# Altium schematic sheet FPGA IO.SchDoc
size A1; SheetNumber: 4; SheetTotal: 16
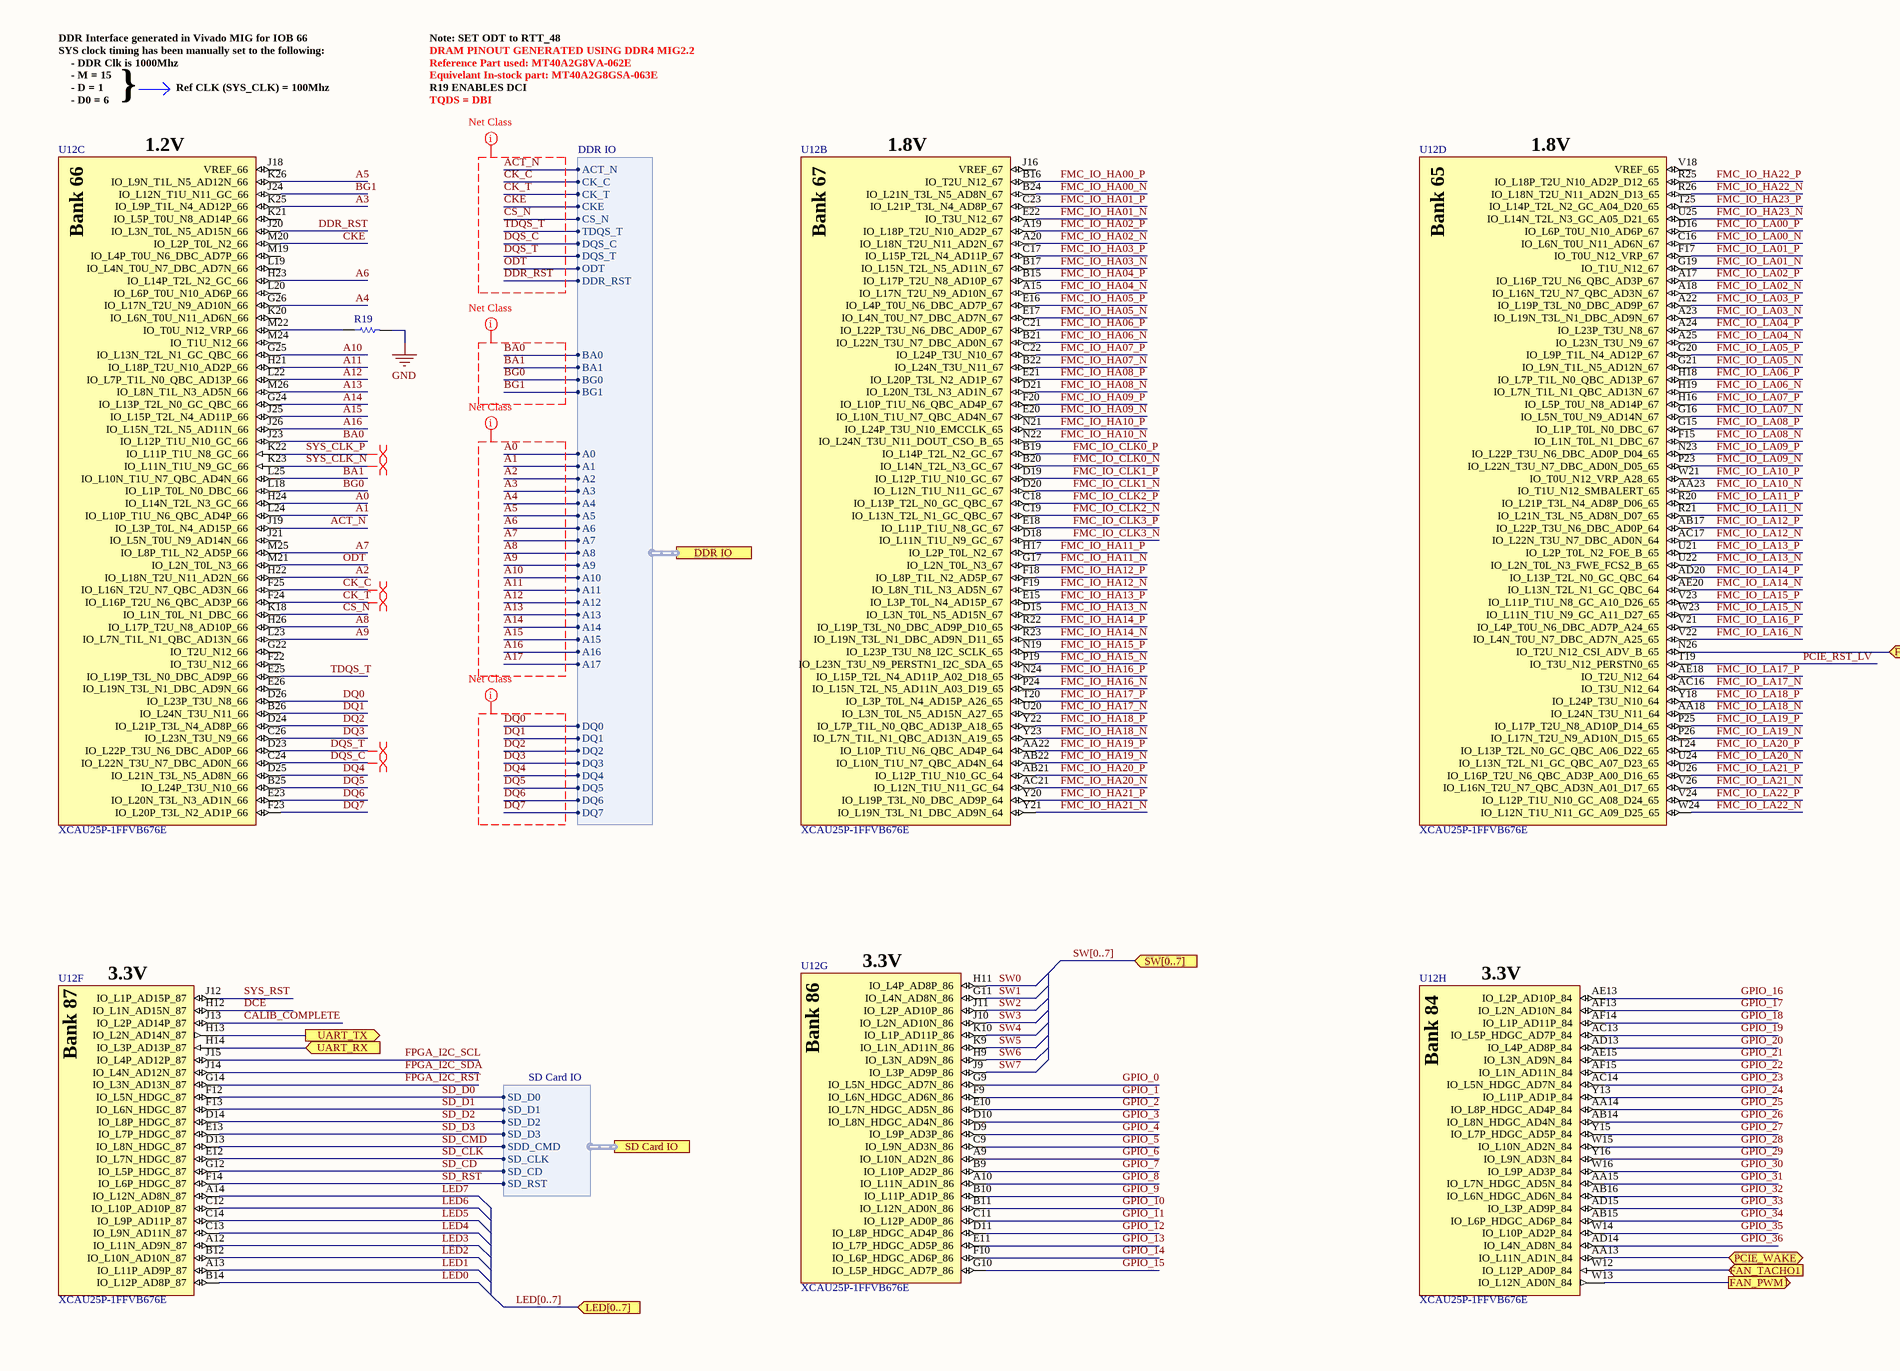
[diagram p0: FPGA IO.SchDoc, top left]
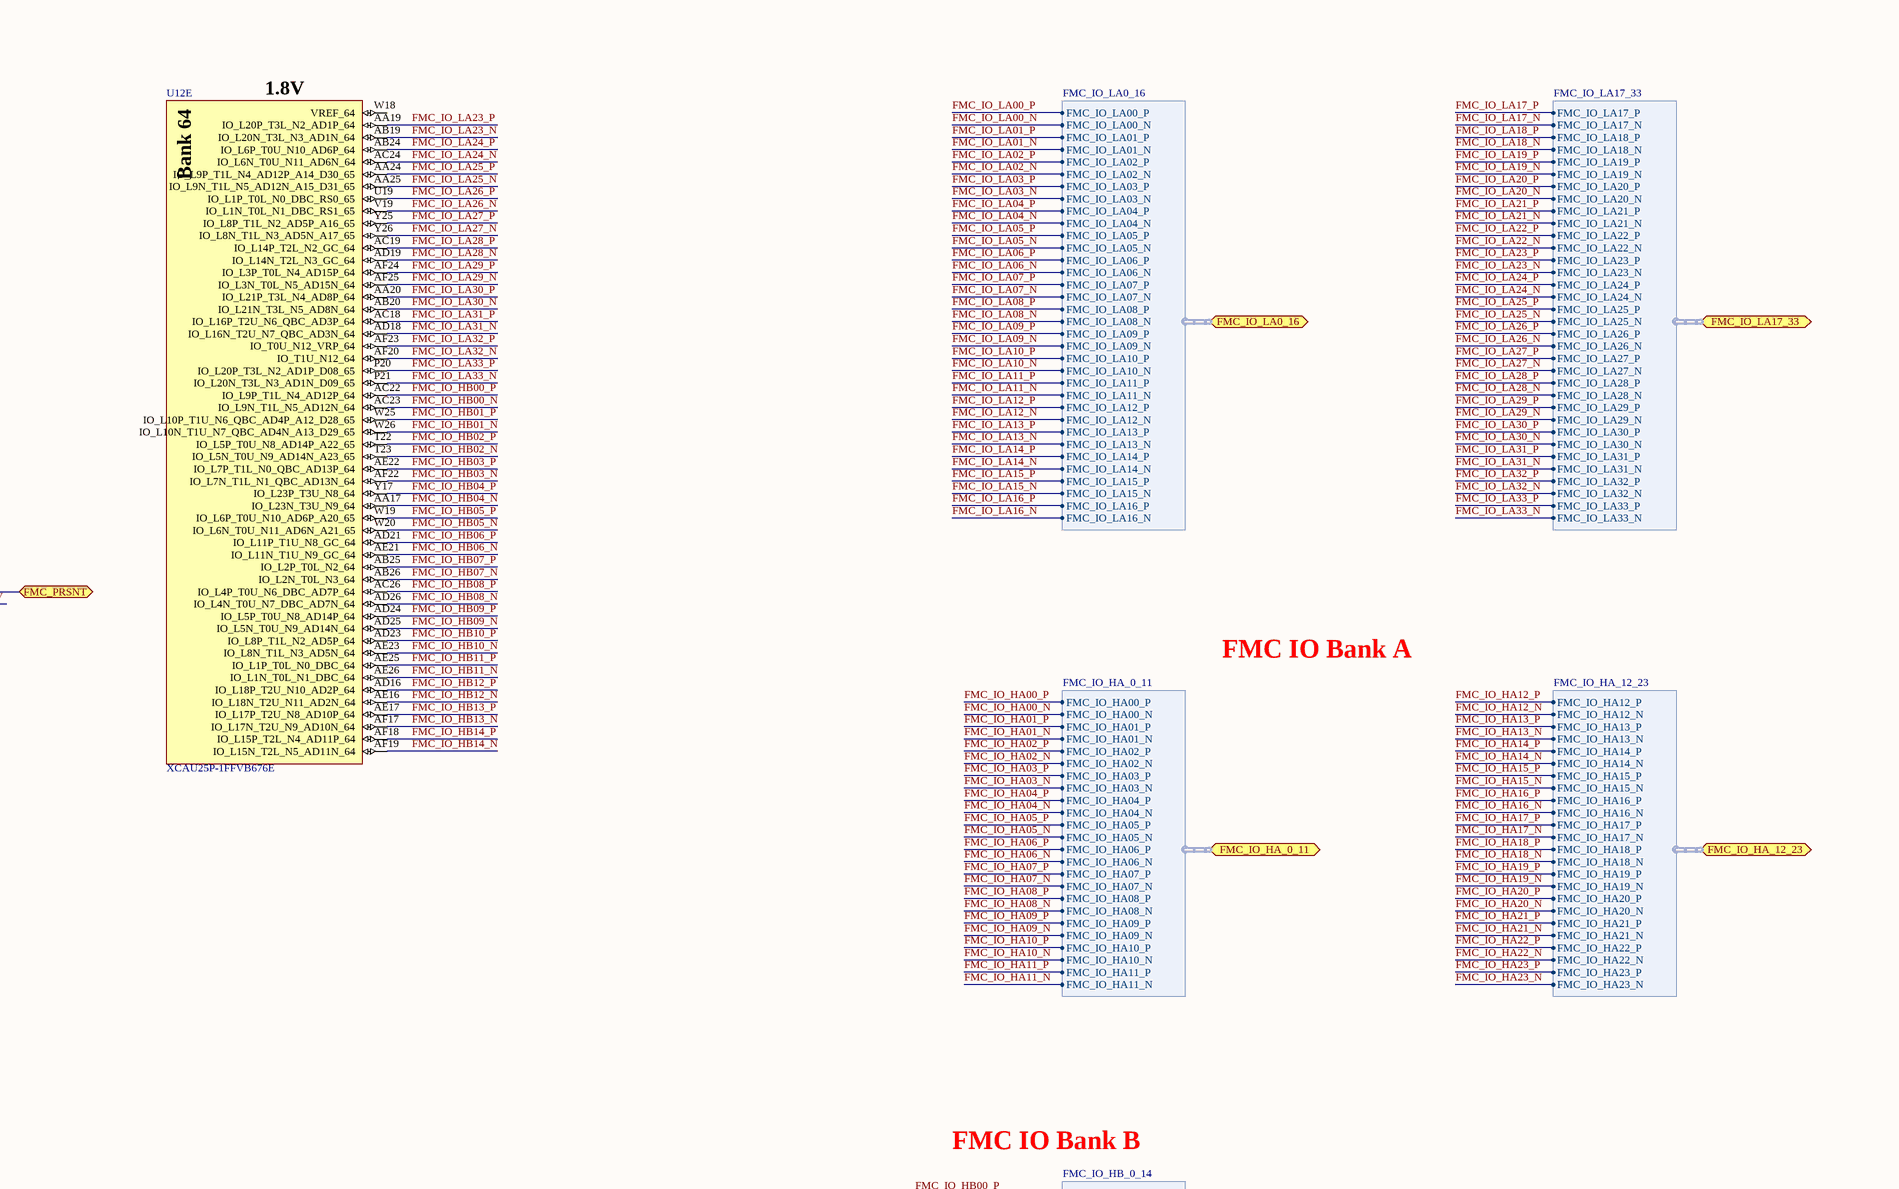
[diagram p1: FPGA IO.SchDoc, top right]
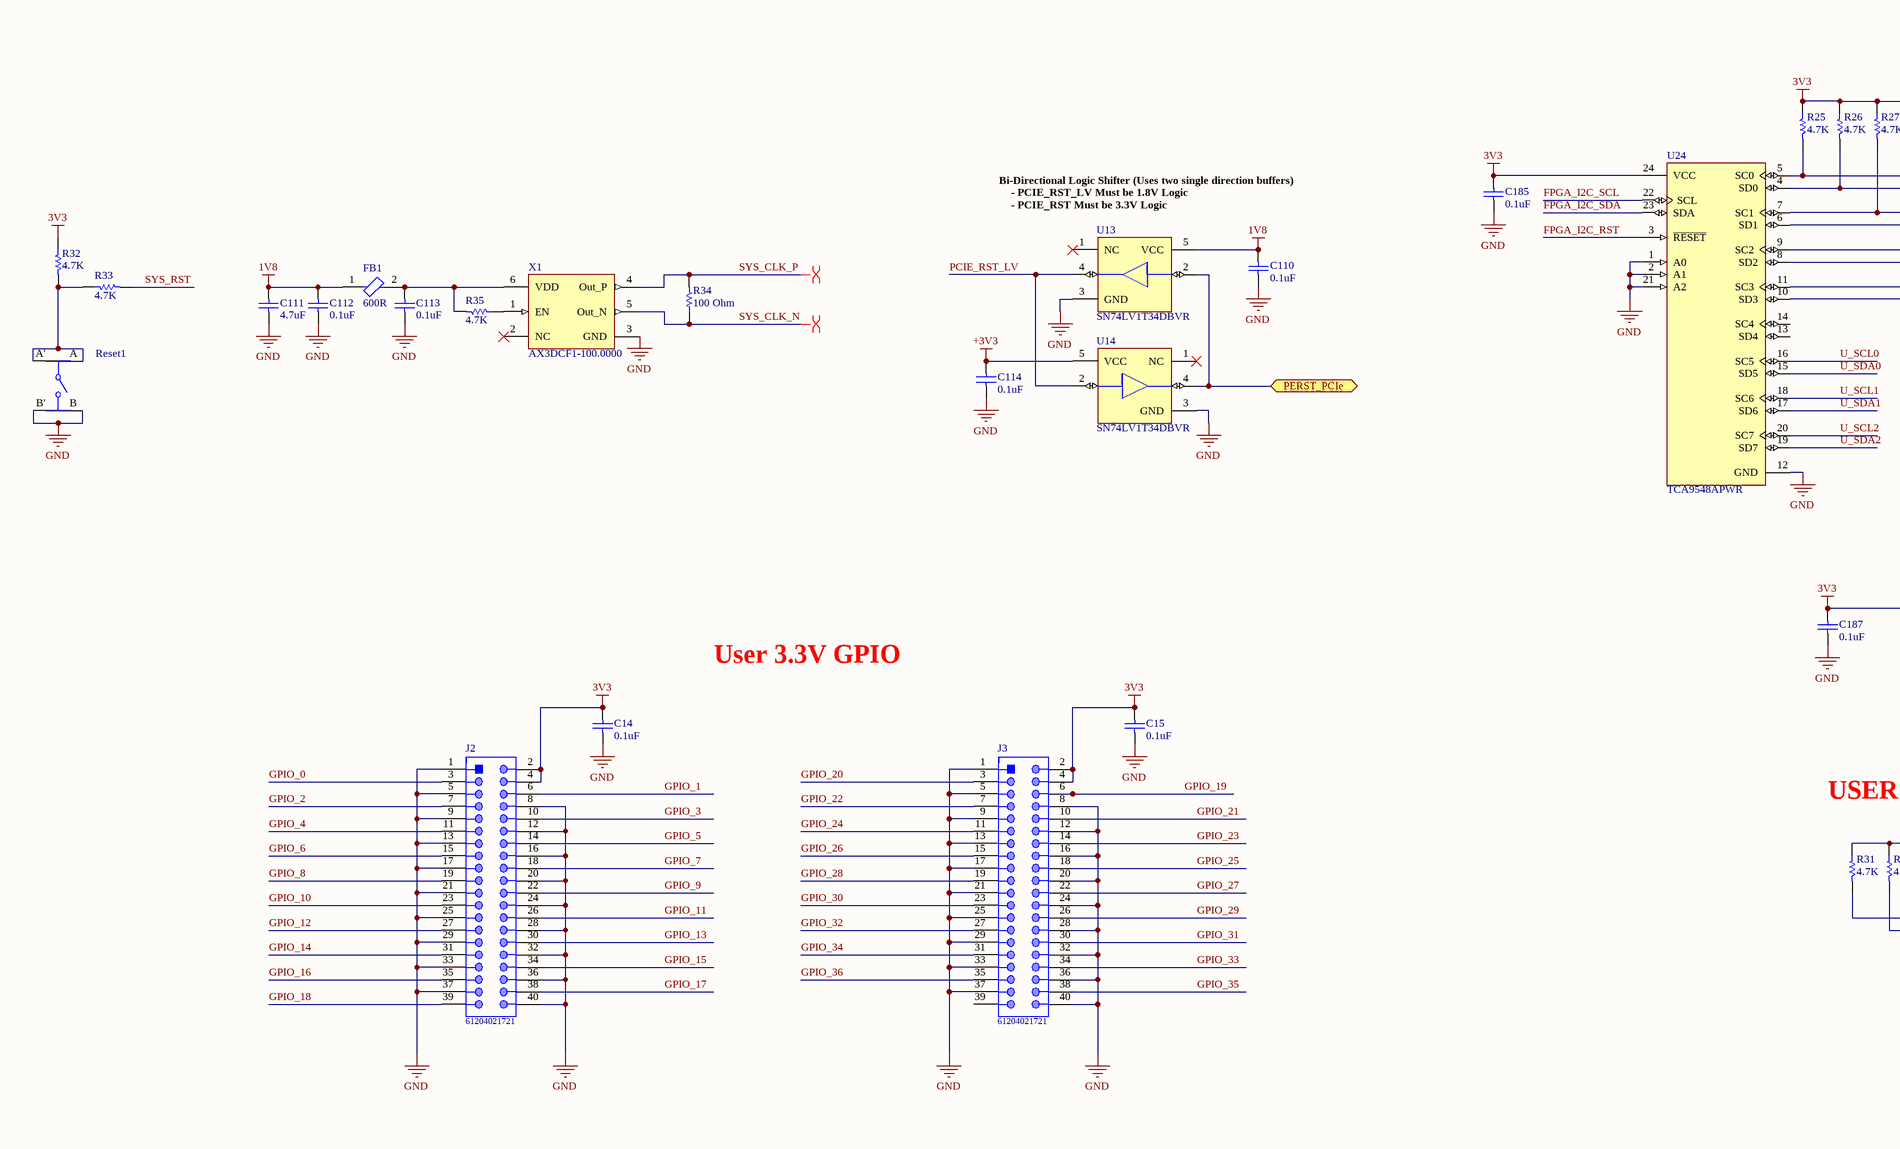
[diagram p2: FPGA IO.SchDoc, bottom left]
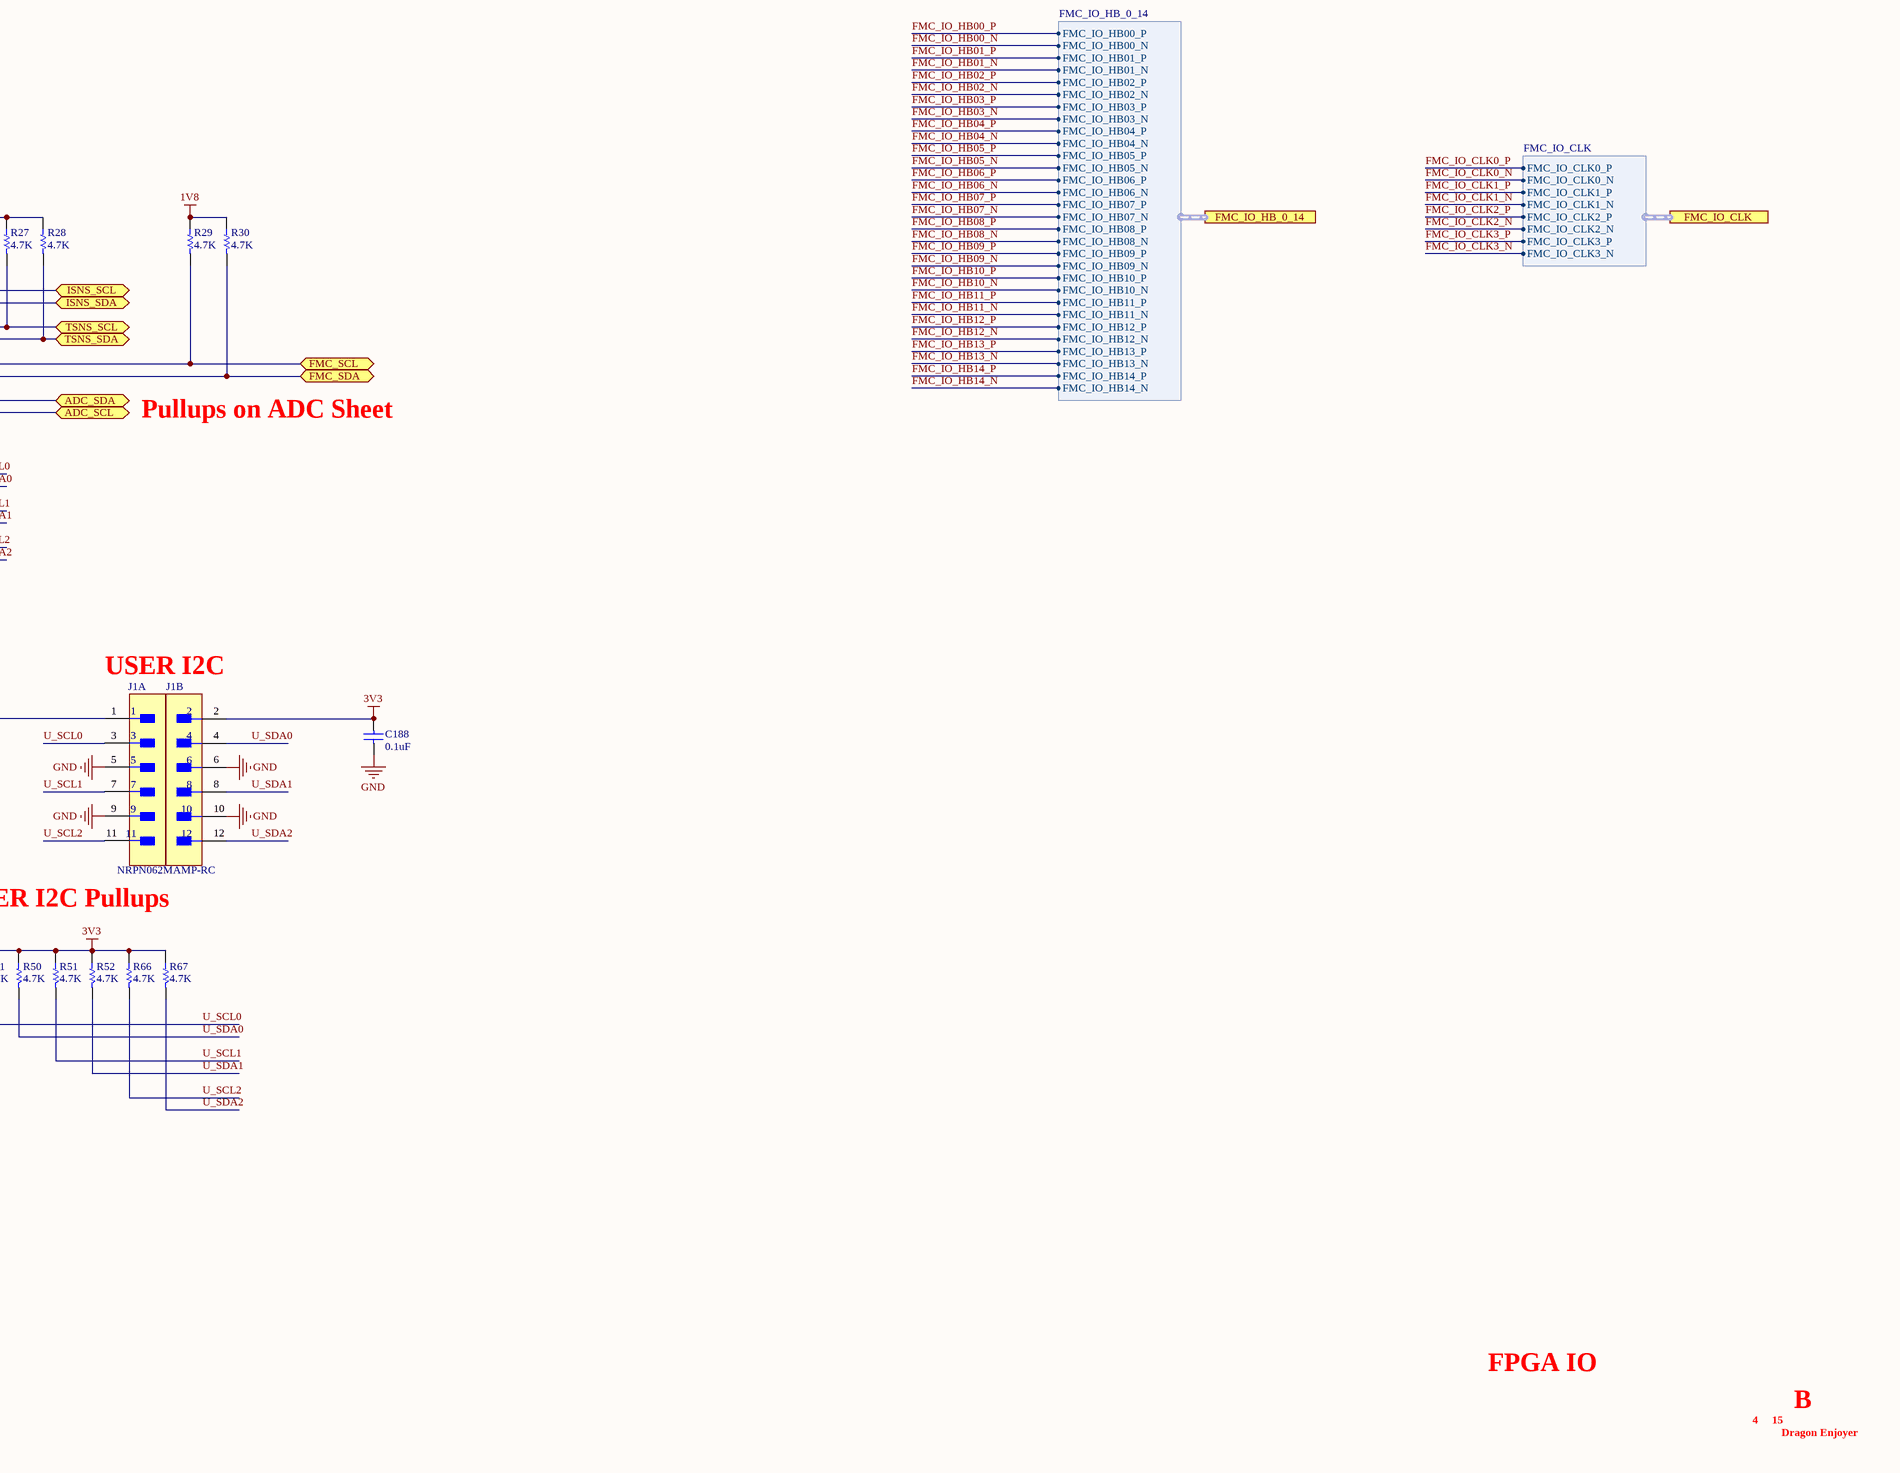
[diagram p3: FPGA IO.SchDoc, bottom right]

## Parts
C14  value 0.1uF  [CAPC1005X56X25LL10T15]  (hidden comment: 04026D104KAT2A)
C15  value 0.1uF  [CAPC1005X56X25LL10T15]  (hidden comment: 04026D104KAT2A)
C110  value 0.1uF  [CAPC1005X56X25LL10T15]  (hidden comment: 04026D104KAT2A)
C111  value 4.7uF  [CAPC2013X135X45LL10T25]  (hidden comment: GRM21BR71A475KA73L)
C112  value 0.1uF  [CAPC1005X56X25LL10T15]  (hidden comment: 04026D104KAT2A)
C113  value 0.1uF  [CAPC1005X56X25LL10T15]  (hidden comment: 04026D104KAT2A)
C114  value 0.1uF  [CAPC1005X56X25LL10T15]  (hidden comment: 04026D104KAT2A)
C185  value 0.1uF  [CAPC1005X56X25LL10T15]  (hidden comment: 04026D104KAT2A)
C187  value 0.1uF  [CAPC1005X56X25LL10T15]  (hidden comment: 04026D104KAT2A)
C188  value 0.1uF  [CAPC1005X56X25LL10T15]  (hidden comment: 04026D104KAT2A)
FB1  Impedance: 600R  [FP-BLM18-0_15-t0_8-IPC_A]  (hidden comment: BLM18KG601SN1D)
J1  NRPN062MAMP-RC  [FP-NRPN062MAMP-RC-MFG]  (value not drawn)  (parts A,B of 2)
J2  61204021721  [61204021721]
J3  61204021721  [61204021721]
R19  CRCW0402240RFKED  [RESC1005X40X25ML05T05]  (value not drawn)
R25  value 4.7K  [RESC1005X40X25LL05T10]  (hidden comment: RC0402JR-074K7L)
R26  value 4.7K  [RESC1005X40X25LL05T10]  (hidden comment: RC0402JR-074K7L)
R27  value 4.7K  [RESC1005X40X25LL05T10]  (hidden comment: RC0402JR-074K7L)
R28  value 4.7K  [RESC1005X40X25LL05T10]  (hidden comment: RC0402JR-074K7L)
R29  value 4.7K  [RESC1005X40X25LL05T10]  (hidden comment: RC0402JR-074K7L)
R30  value 4.7K  [RESC1005X40X25LL05T10]  (hidden comment: RC0402JR-074K7L)
R31  value 4.7K  [RESC1005X40X25LL05T10]  (hidden comment: RC0402JR-074K7L)
R32  value 4.7K  [RESC1005X40X25LL05T10]  (hidden comment: RC0402JR-074K7L)
R33  value 4.7K  [RESC1005X40X25LL05T10]  (hidden comment: RC0402JR-074K7L)
R34  Resistance: 100 Ohm  [RESC1005X40X25LL05T05]  (hidden comment: ERJ-2RKF1000X)
R35  value 4.7K  [RESC1005X40X25LL05T10]  (hidden comment: RC0402JR-074K7L)
R50  value 4.7K  [RESC1005X40X25LL05T10]  (hidden comment: RC0402JR-074K7L)
R51  value 4.7K  [RESC1005X40X25LL05T10]  (hidden comment: RC0402JR-074K7L)
R52  value 4.7K  [RESC1005X40X25LL05T10]  (hidden comment: RC0402JR-074K7L)
R66  value 4.7K  [RESC1005X40X25LL05T10]  (hidden comment: RC0402JR-074K7L)
R67  value 4.7K  [RESC1005X40X25LL05T10]  (hidden comment: RC0402JR-074K7L)
Reset1  EVQ-Q2U03W  [FP-EVQQ2-MFG]  (value not drawn)
U12  XCAU25P-1FFVB676E  [BGA676C100P26X26_2600X2600X352]  (parts B,C,D,E,F,G,H of 14)
U13  SN74LV1T34DBVR  [FP-DBV0005A-MFG]
U14  SN74LV1T34DBVR  [FP-DBV0005A-MFG]
U24  TCA9548APWR  [FP-PW0024A-MFG]
X1  AX3DCF1-100.0000  [CAF-120P320X250-6N]

## Ports
ADC_SCL (bidir), ADC_SDA (bidir), DDR IO (harness DDR IO), FAN_PWM1 (out), FAN_TACHO1 (in), FMC_IO_CLK (harness FMC_IO_CLK), FMC_IO_HA_0_11 (bidir, harness FMC_IO_HA_0_11), FMC_IO_HA_12_23 (bidir, harness FMC_IO_HA_12_23), FMC_IO_HB_0_14 (harness FMC_IO_HB_0_14), FMC_IO_LA0_16 (bidir, harness FMC_IO_LA0_16), FMC_IO_LA17_33 (bidir, harness FMC_IO_LA17_33), FMC_PRSNT (bidir), FMC_SCL (bidir), FMC_SDA (bidir), ISNS_SCL (bidir), ISNS_SDA (bidir), LED[0..7] (in), PCIE_WAKE (bidir), PERST_PCIe (bidir), SD Card IO (harness SD Card IO), SW[0..7] (in), TSNS_SCL (bidir), TSNS_SDA (bidir), UART_RX (in), UART_TX (out)

## Harnesses
DDR IO: ACT_N, CK_C, CK_T, CKE, TDQS_T, DQS_C, DQS_T, ODT, BA0, BA1, BG0, BG1, A0, A1, A2, A3, A4, A5, A6, A7, A8, A9, A10, A11, A12, A13, A14, A15, A16, A17, DQ0, DQ1, DQ2, DQ3, DQ4, DQ5, DQ6, DQ7, DDR_RST, CS_N
FMC_IO_LA0_16: FMC_IO_LA00_P, FMC_IO_LA00_N, FMC_IO_LA01_P, FMC_IO_LA01_N, FMC_IO_LA02_P, FMC_IO_LA02_N, FMC_IO_LA03_P, FMC_IO_LA03_N, FMC_IO_LA04_P, FMC_IO_LA04_N, FMC_IO_LA05_P, FMC_IO_LA05_N, FMC_IO_LA06_P, FMC_IO_LA06_N, FMC_IO_LA07_P, FMC_IO_LA07_N, FMC_IO_LA08_P, FMC_IO_LA08_N, FMC_IO_LA09_P, FMC_IO_LA09_N, FMC_IO_LA10_P, FMC_IO_LA10_N, FMC_IO_LA11_P, FMC_IO_LA11_N, FMC_IO_LA12_P, FMC_IO_LA12_N, FMC_IO_LA13_P, FMC_IO_LA13_N, FMC_IO_LA14_P, FMC_IO_LA14_N, FMC_IO_LA15_P, FMC_IO_LA15_N, FMC_IO_LA16_P, FMC_IO_LA16_N
FMC_IO_LA17_33: FMC_IO_LA17_P, FMC_IO_LA17_N, FMC_IO_LA18_P, FMC_IO_LA18_N, FMC_IO_LA19_P, FMC_IO_LA19_N, FMC_IO_LA20_P, FMC_IO_LA20_N, FMC_IO_LA21_P, FMC_IO_LA21_N, FMC_IO_LA22_P, FMC_IO_LA22_N, FMC_IO_LA23_P, FMC_IO_LA23_N, FMC_IO_LA24_P, FMC_IO_LA24_N, FMC_IO_LA25_P, FMC_IO_LA25_N, FMC_IO_LA26_P, FMC_IO_LA26_N, FMC_IO_LA27_P, FMC_IO_LA27_N, FMC_IO_LA28_P, FMC_IO_LA28_N, FMC_IO_LA29_P, FMC_IO_LA29_N, FMC_IO_LA30_P, FMC_IO_LA30_N, FMC_IO_LA31_P, FMC_IO_LA31_N, FMC_IO_LA32_P, FMC_IO_LA32_N, FMC_IO_LA33_P, FMC_IO_LA33_N
FMC_IO_HA_0_11: FMC_IO_HA00_P, FMC_IO_HA00_N, FMC_IO_HA01_P, FMC_IO_HA01_N, FMC_IO_HA02_P, FMC_IO_HA02_N, FMC_IO_HA03_P, FMC_IO_HA03_N, FMC_IO_HA04_P, FMC_IO_HA04_N, FMC_IO_HA05_P, FMC_IO_HA05_N, FMC_IO_HA06_P, FMC_IO_HA06_N, FMC_IO_HA07_P, FMC_IO_HA07_N, FMC_IO_HA08_P, FMC_IO_HA08_N, FMC_IO_HA09_P, FMC_IO_HA09_N, FMC_IO_HA10_P, FMC_IO_HA10_N, FMC_IO_HA11_P, FMC_IO_HA11_N
FMC_IO_HA_12_23: FMC_IO_HA12_P, FMC_IO_HA12_N, FMC_IO_HA13_P, FMC_IO_HA13_N, FMC_IO_HA14_P, FMC_IO_HA14_N, FMC_IO_HA15_P, FMC_IO_HA15_N, FMC_IO_HA16_P, FMC_IO_HA16_N, FMC_IO_HA17_P, FMC_IO_HA17_N, FMC_IO_HA18_P, FMC_IO_HA18_N, FMC_IO_HA19_P, FMC_IO_HA19_N, FMC_IO_HA20_P, FMC_IO_HA20_N, FMC_IO_HA21_P, FMC_IO_HA21_N, FMC_IO_HA22_P, FMC_IO_HA22_N, FMC_IO_HA23_P, FMC_IO_HA23_N
FMC_IO_CLK: FMC_IO_CLK0_P, FMC_IO_CLK0_N, FMC_IO_CLK1_P, FMC_IO_CLK1_N, FMC_IO_CLK2_P, FMC_IO_CLK2_N, FMC_IO_CLK3_P, FMC_IO_CLK3_N
FMC_IO_HB_0_14: FMC_IO_HB00_P, FMC_IO_HB00_N, FMC_IO_HB01_P, FMC_IO_HB01_N, FMC_IO_HB02_P, FMC_IO_HB02_N, FMC_IO_HB03_P, FMC_IO_HB03_N, FMC_IO_HB04_P, FMC_IO_HB04_N, FMC_IO_HB05_P, FMC_IO_HB05_N, FMC_IO_HB06_P, FMC_IO_HB06_N, FMC_IO_HB07_P, FMC_IO_HB07_N, FMC_IO_HB08_P, FMC_IO_HB08_N, FMC_IO_HB09_P, FMC_IO_HB09_N, FMC_IO_HB10_P, FMC_IO_HB10_N, FMC_IO_HB11_P, FMC_IO_HB11_N, FMC_IO_HB12_P, FMC_IO_HB12_N, FMC_IO_HB13_P, FMC_IO_HB13_N, FMC_IO_HB14_P, FMC_IO_HB14_N
SD Card IO: SD_D0, SD_D1, SD_D2, SD_D3, SDD_CMD, SD_CLK, SD_CD, SD_RST

## Nets
1V8: C110.2 C111.2 C112.2 FB1.1 R29.1 R30.1 U13.5(VCC)
3V3: C14.2 C15.2 C185.1 C187.1 C188.1 J1.1 J1.2 J2.2 J2.4 J3.2 J3.4 R25.1 R26.1 R27.1 R28.1 R31.1 R32.1 R50.1 R51.1 R52.1 R66.1 R67.1 U24.24(VCC)
+3V3: C114.2 U14.5(VCC)
GND: C14.1 C15.1 C110.1 C111.1 C112.1 C113.1 C114.1 C185.2 C187.2 C188.2 J1.5 J1.6 J1.9 J1.10 J2.1 J2.5 J2.8 J2.9 J2.12 J2.13 J2.16 J2.17 J2.20 J2.21 J2.24 J2.25 J2.28 J2.29 J2.32 J2.33 J2.36 J2.37 J2.40 J3.1 J3.5 J3.8 J3.9 J3.12 J3.13 J3.16 J3.17 J3.20 J3.21 J3.24 J3.25 J3.28 J3.29 J3.32 J3.33 J3.36 J3.37 J3.40 R19.2 Reset1.B Reset1.B' U13.3(GND) U14.3(GND) U24.1(A0) U24.2(A1) U24.12(GND) U24.21(A2) X1.3(GND)
A0: U12.H24(IO_L14N_T2L_N3_GC_66) ; port DDR IO.A0
A1: U12.L24(IO_L10P_T1U_N6_QBC_AD4P_66) ; port DDR IO.A1
A2: U12.H22(IO_L18N_T2U_N11_AD2N_66) ; port DDR IO.A2
A3: U12.K25(IO_L9P_T1L_N4_AD12P_66) ; port DDR IO.A3
A4: U12.G26(IO_L17N_T2U_N9_AD10N_66) ; port DDR IO.A4
A5: U12.K26(IO_L9N_T1L_N5_AD12N_66) ; port DDR IO.A5
A6: U12.H23(IO_L14P_T2L_N2_GC_66) ; port DDR IO.A6
A7: U12.M25(IO_L8P_T1L_N2_AD5P_66) ; port DDR IO.A7
A8: U12.H26(IO_L17P_T2U_N8_AD10P_66) ; port DDR IO.A8
A9: U12.L23(IO_L7N_T1L_N1_QBC_AD13N_66) ; port DDR IO.A9
A10: U12.G25(IO_L13N_T2L_N1_GC_QBC_66) ; port DDR IO.A10
A11: U12.H21(IO_L18P_T2U_N10_AD2P_66) ; port DDR IO.A11
A12: U12.L22(IO_L7P_T1L_N0_QBC_AD13P_66) ; port DDR IO.A12
A13: U12.M26(IO_L8N_T1L_N3_AD5N_66) ; port DDR IO.A13
A14: U12.G24(IO_L13P_T2L_N0_GC_QBC_66) ; port DDR IO.A14
A15: U12.J25(IO_L15P_T2L_N4_AD11P_66) ; port DDR IO.A15
A16: U12.J26(IO_L15N_T2L_N5_AD11N_66) ; port DDR IO.A16
A17: port DDR IO.A17
ACT_N: U12.J19(IO_L3P_T0L_N4_AD15P_66) ; port DDR IO.ACT_N
ADC_SCL: U24.10(SD3) ; port ADC_SCL
ADC_SDA: U24.11(SC3) ; port ADC_SDA
BA0: U12.J23(IO_L12P_T1U_N10_GC_66) ; port DDR IO.BA0
BA1: U12.L25(IO_L10N_T1U_N7_QBC_AD4N_66) ; port DDR IO.BA1
BG0: U12.L18(IO_L1P_T0L_N0_DBC_66) ; port DDR IO.BG0
BG1: U12.J24(IO_L12N_T1U_N11_GC_66) ; port DDR IO.BG1
CALIB_COMPLETE: U12.J13(IO_L2P_AD14P_87)
CK_C: U12.F25(IO_L16N_T2U_N7_QBC_AD3N_66) ; port DDR IO.CK_C
CK_T: U12.F24(IO_L16P_T2U_N6_QBC_AD3P_66) ; port DDR IO.CK_T
CKE: U12.M20(IO_L2P_T0L_N2_66) ; port DDR IO.CKE
CS_N: U12.K18(IO_L1N_T0L_N1_DBC_66) ; port DDR IO.CS_N
DCE: U12.H12(IO_L1N_AD15N_87)
DDR_RST: U12.J20(IO_L3N_T0L_N5_AD15N_66) ; port DDR IO.DDR_RST
DQ0: U12.D26(IO_L23P_T3U_N8_66) ; port DDR IO.DQ0
DQ1: U12.B26(IO_L24N_T3U_N11_66) ; port DDR IO.DQ1
DQ2: U12.D24(IO_L21P_T3L_N4_AD8P_66) ; port DDR IO.DQ2
DQ3: U12.C26(IO_L23N_T3U_N9_66) ; port DDR IO.DQ3
DQ4: U12.D25(IO_L21N_T3L_N5_AD8N_66) ; port DDR IO.DQ4
DQ5: U12.B25(IO_L24P_T3U_N10_66) ; port DDR IO.DQ5
DQ6: U12.E23(IO_L20N_T3L_N3_AD1N_66) ; port DDR IO.DQ6
DQ7: U12.F23(IO_L20P_T3L_N2_AD1P_66) ; port DDR IO.DQ7
DQS_C: U12.C24(IO_L22N_T3U_N7_DBC_AD0N_66) ; port DDR IO.DQS_C
DQS_T: U12.D23(IO_L22P_T3U_N6_DBC_AD0P_66) ; port DDR IO.DQS_T
FAN_PWM1: U12.W13(IO_L12N_AD0N_84) ; port FAN_PWM1
FAN_TACHO1: U12.W12(IO_L12P_AD0P_84) ; port FAN_TACHO1
FMC_IO_CLK0_N: U12.B20(IO_L14N_T2L_N3_GC_67) ; port FMC_IO_CLK.FMC_IO_CLK0_N
FMC_IO_CLK0_P: U12.B19(IO_L14P_T2L_N2_GC_67) ; port FMC_IO_CLK.FMC_IO_CLK0_P
FMC_IO_CLK1_N: U12.D20(IO_L12N_T1U_N11_GC_67) ; port FMC_IO_CLK.FMC_IO_CLK1_N
FMC_IO_CLK1_P: U12.D19(IO_L12P_T1U_N10_GC_67) ; port FMC_IO_CLK.FMC_IO_CLK1_P
FMC_IO_CLK2_N: U12.C19(IO_L13N_T2L_N1_GC_QBC_67) ; port FMC_IO_CLK.FMC_IO_CLK2_N
FMC_IO_CLK2_P: U12.C18(IO_L13P_T2L_N0_GC_QBC_67) ; port FMC_IO_CLK.FMC_IO_CLK2_P
FMC_IO_CLK3_N: U12.D18(IO_L11N_T1U_N9_GC_67) ; port FMC_IO_CLK.FMC_IO_CLK3_N
FMC_IO_CLK3_P: U12.E18(IO_L11P_T1U_N8_GC_67) ; port FMC_IO_CLK.FMC_IO_CLK3_P
FMC_IO_HA00_N: U12.B24(IO_L21N_T3L_N5_AD8N_67) ; port FMC_IO_HA_0_11.FMC_IO_HA00_N
FMC_IO_HA00_P: U12.B16(IO_T2U_N12_67) ; port FMC_IO_HA_0_11.FMC_IO_HA00_P
FMC_IO_HA01_N: U12.E22(IO_T3U_N12_67) ; port FMC_IO_HA_0_11.FMC_IO_HA01_N
FMC_IO_HA01_P: U12.C23(IO_L21P_T3L_N4_AD8P_67) ; port FMC_IO_HA_0_11.FMC_IO_HA01_P
FMC_IO_HA02_N: U12.A20(IO_L18N_T2U_N11_AD2N_67) ; port FMC_IO_HA_0_11.FMC_IO_HA02_N
FMC_IO_HA02_P: U12.A19(IO_L18P_T2U_N10_AD2P_67) ; port FMC_IO_HA_0_11.FMC_IO_HA02_P
FMC_IO_HA03_N: U12.B17(IO_L15N_T2L_N5_AD11N_67) ; port FMC_IO_HA_0_11.FMC_IO_HA03_N
FMC_IO_HA03_P: U12.C17(IO_L15P_T2L_N4_AD11P_67) ; port FMC_IO_HA_0_11.FMC_IO_HA03_P
FMC_IO_HA04_N: U12.A15(IO_L17N_T2U_N9_AD10N_67) ; port FMC_IO_HA_0_11.FMC_IO_HA04_N
FMC_IO_HA04_P: U12.B15(IO_L17P_T2U_N8_AD10P_67) ; port FMC_IO_HA_0_11.FMC_IO_HA04_P
FMC_IO_HA05_N: U12.E17(IO_L4N_T0U_N7_DBC_AD7N_67) ; port FMC_IO_HA_0_11.FMC_IO_HA05_N
FMC_IO_HA05_P: U12.E16(IO_L4P_T0U_N6_DBC_AD7P_67) ; port FMC_IO_HA_0_11.FMC_IO_HA05_P
FMC_IO_HA06_N: U12.B21(IO_L22N_T3U_N7_DBC_AD0N_67) ; port FMC_IO_HA_0_11.FMC_IO_HA06_N
FMC_IO_HA06_P: U12.C21(IO_L22P_T3U_N6_DBC_AD0P_67) ; port FMC_IO_HA_0_11.FMC_IO_HA06_P
FMC_IO_HA07_N: U12.B22(IO_L24N_T3U_N11_67) ; port FMC_IO_HA_0_11.FMC_IO_HA07_N
FMC_IO_HA07_P: U12.C22(IO_L24P_T3U_N10_67) ; port FMC_IO_HA_0_11.FMC_IO_HA07_P
FMC_IO_HA08_N: U12.D21(IO_L20N_T3L_N3_AD1N_67) ; port FMC_IO_HA_0_11.FMC_IO_HA08_N
FMC_IO_HA08_P: U12.E21(IO_L20P_T3L_N2_AD1P_67) ; port FMC_IO_HA_0_11.FMC_IO_HA08_P
FMC_IO_HA09_N: U12.E20(IO_L10N_T1U_N7_QBC_AD4N_67) ; port FMC_IO_HA_0_11.FMC_IO_HA09_N
FMC_IO_HA09_P: U12.F20(IO_L10P_T1U_N6_QBC_AD4P_67) ; port FMC_IO_HA_0_11.FMC_IO_HA09_P
FMC_IO_HA10_N: U12.N22(IO_L24N_T3U_N11_DOUT_CSO_B_65) ; port FMC_IO_HA_0_11.FMC_IO_HA10_N
FMC_IO_HA10_P: U12.N21(IO_L24P_T3U_N10_EMCCLK_65) ; port FMC_IO_HA_0_11.FMC_IO_HA10_P
FMC_IO_HA11_N: U12.G17(IO_L2N_T0L_N3_67) ; port FMC_IO_HA_0_11.FMC_IO_HA11_N
FMC_IO_HA11_P: U12.H17(IO_L2P_T0L_N2_67) ; port FMC_IO_HA_0_11.FMC_IO_HA11_P
FMC_IO_HA12_N: U12.F19(IO_L8N_T1L_N3_AD5N_67) ; port FMC_IO_HA_12_23.FMC_IO_HA12_N
FMC_IO_HA12_P: U12.F18(IO_L8P_T1L_N2_AD5P_67) ; port FMC_IO_HA_12_23.FMC_IO_HA12_P
FMC_IO_HA13_N: U12.D15(IO_L3N_T0L_N5_AD15N_67) ; port FMC_IO_HA_12_23.FMC_IO_HA13_N
FMC_IO_HA13_P: U12.E15(IO_L3P_T0L_N4_AD15P_67) ; port FMC_IO_HA_12_23.FMC_IO_HA13_P
FMC_IO_HA14_N: U12.R23(IO_L19N_T3L_N1_DBC_AD9N_D11_65) ; port FMC_IO_HA_12_23.FMC_IO_HA14_N
FMC_IO_HA14_P: U12.R22(IO_L19P_T3L_N0_DBC_AD9P_D10_65) ; port FMC_IO_HA_12_23.FMC_IO_HA14_P
FMC_IO_HA15_N: U12.P19(IO_L23N_T3U_N9_PERSTN1_I2C_SDA_65) ; port FMC_IO_HA_12_23.FMC_IO_HA15_N
FMC_IO_HA15_P: U12.N19(IO_L23P_T3U_N8_I2C_SCLK_65) ; port FMC_IO_HA_12_23.FMC_IO_HA15_P
FMC_IO_HA16_N: U12.P24(IO_L15N_T2L_N5_AD11N_A03_D19_65) ; port FMC_IO_HA_12_23.FMC_IO_HA16_N
FMC_IO_HA16_P: U12.N24(IO_L15P_T2L_N4_AD11P_A02_D18_65) ; port FMC_IO_HA_12_23.FMC_IO_HA16_P
FMC_IO_HA17_N: U12.U20(IO_L3N_T0L_N5_AD15N_A27_65) ; port FMC_IO_HA_12_23.FMC_IO_HA17_N
FMC_IO_HA17_P: U12.T20(IO_L3P_T0L_N4_AD15P_A26_65) ; port FMC_IO_HA_12_23.FMC_IO_HA17_P
FMC_IO_HA18_N: U12.Y23(IO_L7N_T1L_N1_QBC_AD13N_A19_65) ; port FMC_IO_HA_12_23.FMC_IO_HA18_N
FMC_IO_HA18_P: U12.Y22(IO_L7P_T1L_N0_QBC_AD13P_A18_65) ; port FMC_IO_HA_12_23.FMC_IO_HA18_P
FMC_IO_HA19_N: U12.AB22(IO_L10N_T1U_N7_QBC_AD4N_64) ; port FMC_IO_HA_12_23.FMC_IO_HA19_N
FMC_IO_HA19_P: U12.AA22(IO_L10P_T1U_N6_QBC_AD4P_64) ; port FMC_IO_HA_12_23.FMC_IO_HA19_P
FMC_IO_HA20_N: U12.AC21(IO_L12N_T1U_N11_GC_64) ; port FMC_IO_HA_12_23.FMC_IO_HA20_N
FMC_IO_HA20_P: U12.AB21(IO_L12P_T1U_N10_GC_64) ; port FMC_IO_HA_12_23.FMC_IO_HA20_P
FMC_IO_HA21_N: U12.Y21(IO_L19N_T3L_N1_DBC_AD9N_64) ; port FMC_IO_HA_12_23.FMC_IO_HA21_N
FMC_IO_HA21_P: U12.Y20(IO_L19P_T3L_N0_DBC_AD9P_64) ; port FMC_IO_HA_12_23.FMC_IO_HA21_P
FMC_IO_HA22_N: U12.R26(IO_L18N_T2U_N11_AD2N_D13_65) ; port FMC_IO_HA_12_23.FMC_IO_HA22_N
FMC_IO_HA22_P: U12.R25(IO_L18P_T2U_N10_AD2P_D12_65) ; port FMC_IO_HA_12_23.FMC_IO_HA22_P
FMC_IO_HA23_N: U12.U25(IO_L14N_T2L_N3_GC_A05_D21_65) ; port FMC_IO_HA_12_23.FMC_IO_HA23_N
FMC_IO_HA23_P: U12.T25(IO_L14P_T2L_N2_GC_A04_D20_65) ; port FMC_IO_HA_12_23.FMC_IO_HA23_P
FMC_IO_HB00_N: U12.AC23(IO_L9N_T1L_N5_AD12N_64) ; port FMC_IO_HB_0_14.FMC_IO_HB00_N
FMC_IO_HB00_P: U12.AC22(IO_L9P_T1L_N4_AD12P_64) ; port FMC_IO_HB_0_14.FMC_IO_HB00_P
FMC_IO_HB01_N: U12.W26(IO_L10N_T1U_N7_QBC_AD4N_A13_D29_65) ; port FMC_IO_HB_0_14.FMC_IO_HB01_N
FMC_IO_HB01_P: U12.W25(IO_L10P_T1U_N6_QBC_AD4P_A12_D28_65) ; port FMC_IO_HB_0_14.FMC_IO_HB01_P
FMC_IO_HB02_N: U12.T23(IO_L5N_T0U_N9_AD14N_A23_65) ; port FMC_IO_HB_0_14.FMC_IO_HB02_N
FMC_IO_HB02_P: U12.T22(IO_L5P_T0U_N8_AD14P_A22_65) ; port FMC_IO_HB_0_14.FMC_IO_HB02_P
FMC_IO_HB03_N: U12.AF22(IO_L7N_T1L_N1_QBC_AD13N_64) ; port FMC_IO_HB_0_14.FMC_IO_HB03_N
FMC_IO_HB03_P: U12.AE22(IO_L7P_T1L_N0_QBC_AD13P_64) ; port FMC_IO_HB_0_14.FMC_IO_HB03_P
FMC_IO_HB04_N: U12.AA17(IO_L23N_T3U_N9_64) ; port FMC_IO_HB_0_14.FMC_IO_HB04_N
FMC_IO_HB04_P: U12.Y17(IO_L23P_T3U_N8_64) ; port FMC_IO_HB_0_14.FMC_IO_HB04_P
FMC_IO_HB05_N: U12.W20(IO_L6N_T0U_N11_AD6N_A21_65) ; port FMC_IO_HB_0_14.FMC_IO_HB05_N
FMC_IO_HB05_P: U12.W19(IO_L6P_T0U_N10_AD6P_A20_65) ; port FMC_IO_HB_0_14.FMC_IO_HB05_P
FMC_IO_HB06_N: U12.AE21(IO_L11N_T1U_N9_GC_64) ; port FMC_IO_HB_0_14.FMC_IO_HB06_N
FMC_IO_HB06_P: U12.AD21(IO_L11P_T1U_N8_GC_64) ; port FMC_IO_HB_0_14.FMC_IO_HB06_P
FMC_IO_HB07_N: U12.AB26(IO_L2N_T0L_N3_64) ; port FMC_IO_HB_0_14.FMC_IO_HB07_N
FMC_IO_HB07_P: U12.AB25(IO_L2P_T0L_N2_64) ; port FMC_IO_HB_0_14.FMC_IO_HB07_P
FMC_IO_HB08_N: U12.AD26(IO_L4N_T0U_N7_DBC_AD7N_64) ; port FMC_IO_HB_0_14.FMC_IO_HB08_N
FMC_IO_HB08_P: U12.AC26(IO_L4P_T0U_N6_DBC_AD7P_64) ; port FMC_IO_HB_0_14.FMC_IO_HB08_P
FMC_IO_HB09_N: U12.AD25(IO_L5N_T0U_N9_AD14N_64) ; port FMC_IO_HB_0_14.FMC_IO_HB09_N
FMC_IO_HB09_P: U12.AD24(IO_L5P_T0U_N8_AD14P_64) ; port FMC_IO_HB_0_14.FMC_IO_HB09_P
FMC_IO_HB10_N: U12.AE23(IO_L8N_T1L_N3_AD5N_64) ; port FMC_IO_HB_0_14.FMC_IO_HB10_N
FMC_IO_HB10_P: U12.AD23(IO_L8P_T1L_N2_AD5P_64) ; port FMC_IO_HB_0_14.FMC_IO_HB10_P
FMC_IO_HB11_N: U12.AE26(IO_L1N_T0L_N1_DBC_64) ; port FMC_IO_HB_0_14.FMC_IO_HB11_N
FMC_IO_HB11_P: U12.AE25(IO_L1P_T0L_N0_DBC_64) ; port FMC_IO_HB_0_14.FMC_IO_HB11_P
FMC_IO_HB12_N: U12.AE16(IO_L18N_T2U_N11_AD2N_64) ; port FMC_IO_HB_0_14.FMC_IO_HB12_N
FMC_IO_HB12_P: U12.AD16(IO_L18P_T2U_N10_AD2P_64) ; port FMC_IO_HB_0_14.FMC_IO_HB12_P
FMC_IO_HB13_N: U12.AF17(IO_L17N_T2U_N9_AD10N_64) ; port FMC_IO_HB_0_14.FMC_IO_HB13_N
FMC_IO_HB13_P: U12.AE17(IO_L17P_T2U_N8_AD10P_64) ; port FMC_IO_HB_0_14.FMC_IO_HB13_P
FMC_IO_HB14_N: U12.AF19(IO_L15N_T2L_N5_AD11N_64) ; port FMC_IO_HB_0_14.FMC_IO_HB14_N
FMC_IO_HB14_P: U12.AF18(IO_L15P_T2L_N4_AD11P_64) ; port FMC_IO_HB_0_14.FMC_IO_HB14_P
FMC_IO_LA00_N: U12.C16(IO_L6N_T0U_N11_AD6N_67) ; port FMC_IO_LA0_16.FMC_IO_LA00_N
FMC_IO_LA00_P: U12.D16(IO_L6P_T0U_N10_AD6P_67) ; port FMC_IO_LA0_16.FMC_IO_LA00_P
FMC_IO_LA01_N: U12.G19(IO_T1U_N12_67) ; port FMC_IO_LA0_16.FMC_IO_LA01_N
FMC_IO_LA01_P: U12.F17(IO_T0U_N12_VRP_67) ; port FMC_IO_LA0_16.FMC_IO_LA01_P
FMC_IO_LA02_N: U12.A18(IO_L16N_T2U_N7_QBC_AD3N_67) ; port FMC_IO_LA0_16.FMC_IO_LA02_N
FMC_IO_LA02_P: U12.A17(IO_L16P_T2U_N6_QBC_AD3P_67) ; port FMC_IO_LA0_16.FMC_IO_LA02_P
FMC_IO_LA03_N: U12.A23(IO_L19N_T3L_N1_DBC_AD9N_67) ; port FMC_IO_LA0_16.FMC_IO_LA03_N
FMC_IO_LA03_P: U12.A22(IO_L19P_T3L_N0_DBC_AD9P_67) ; port FMC_IO_LA0_16.FMC_IO_LA03_P
FMC_IO_LA04_N: U12.A25(IO_L23N_T3U_N9_67) ; port FMC_IO_LA0_16.FMC_IO_LA04_N
FMC_IO_LA04_P: U12.A24(IO_L23P_T3U_N8_67) ; port FMC_IO_LA0_16.FMC_IO_LA04_P
FMC_IO_LA05_N: U12.G21(IO_L9N_T1L_N5_AD12N_67) ; port FMC_IO_LA0_16.FMC_IO_LA05_N
FMC_IO_LA05_P: U12.G20(IO_L9P_T1L_N4_AD12P_67) ; port FMC_IO_LA0_16.FMC_IO_LA05_P
FMC_IO_LA06_N: U12.H19(IO_L7N_T1L_N1_QBC_AD13N_67) ; port FMC_IO_LA0_16.FMC_IO_LA06_N
FMC_IO_LA06_P: U12.H18(IO_L7P_T1L_N0_QBC_AD13P_67) ; port FMC_IO_LA0_16.FMC_IO_LA06_P
FMC_IO_LA07_N: U12.G16(IO_L5N_T0U_N9_AD14N_67) ; port FMC_IO_LA0_16.FMC_IO_LA07_N
FMC_IO_LA07_P: U12.H16(IO_L5P_T0U_N8_AD14P_67) ; port FMC_IO_LA0_16.FMC_IO_LA07_P
FMC_IO_LA08_N: U12.F15(IO_L1N_T0L_N1_DBC_67) ; port FMC_IO_LA0_16.FMC_IO_LA08_N
FMC_IO_LA08_P: U12.G15(IO_L1P_T0L_N0_DBC_67) ; port FMC_IO_LA0_16.FMC_IO_LA08_P
FMC_IO_LA09_N: U12.P23(IO_L22N_T3U_N7_DBC_AD0N_D05_65) ; port FMC_IO_LA0_16.FMC_IO_LA09_N
FMC_IO_LA09_P: U12.N23(IO_L22P_T3U_N6_DBC_AD0P_D04_65) ; port FMC_IO_LA0_16.FMC_IO_LA09_P
FMC_IO_LA10_N: U12.AA23(IO_T1U_N12_SMBALERT_65) ; port FMC_IO_LA0_16.FMC_IO_LA10_N
FMC_IO_LA10_P: U12.W21(IO_T0U_N12_VRP_A28_65) ; port FMC_IO_LA0_16.FMC_IO_LA10_P
FMC_IO_LA11_N: U12.R21(IO_L21N_T3L_N5_AD8N_D07_65) ; port FMC_IO_LA0_16.FMC_IO_LA11_N
FMC_IO_LA11_P: U12.R20(IO_L21P_T3L_N4_AD8P_D06_65) ; port FMC_IO_LA0_16.FMC_IO_LA11_P
FMC_IO_LA12_N: U12.AC17(IO_L22N_T3U_N7_DBC_AD0N_64) ; port FMC_IO_LA0_16.FMC_IO_LA12_N
FMC_IO_LA12_P: U12.AB17(IO_L22P_T3U_N6_DBC_AD0P_64) ; port FMC_IO_LA0_16.FMC_IO_LA12_P
FMC_IO_LA13_N: U12.U22(IO_L2N_T0L_N3_FWE_FCS2_B_65) ; port FMC_IO_LA0_16.FMC_IO_LA13_N
FMC_IO_LA13_P: U12.U21(IO_L2P_T0L_N2_FOE_B_65) ; port FMC_IO_LA0_16.FMC_IO_LA13_P
FMC_IO_LA14_N: U12.AE20(IO_L13N_T2L_N1_GC_QBC_64) ; port FMC_IO_LA0_16.FMC_IO_LA14_N
FMC_IO_LA14_P: U12.AD20(IO_L13P_T2L_N0_GC_QBC_64) ; port FMC_IO_LA0_16.FMC_IO_LA14_P
FMC_IO_LA15_N: U12.W23(IO_L11N_T1U_N9_GC_A11_D27_65) ; port FMC_IO_LA0_16.FMC_IO_LA15_N
FMC_IO_LA15_P: U12.V23(IO_L11P_T1U_N8_GC_A10_D26_65) ; port FMC_IO_LA0_16.FMC_IO_LA15_P
FMC_IO_LA16_N: U12.V22(IO_L4N_T0U_N7_DBC_AD7N_A25_65) ; port FMC_IO_LA0_16.FMC_IO_LA16_N
FMC_IO_LA16_P: U12.V21(IO_L4P_T0U_N6_DBC_AD7P_A24_65) ; port FMC_IO_LA0_16.FMC_IO_LA16_P
FMC_IO_LA17_N: U12.AC16(IO_T3U_N12_64) ; port FMC_IO_LA17_33.FMC_IO_LA17_N
FMC_IO_LA17_P: U12.AE18(IO_T2U_N12_64) ; port FMC_IO_LA17_33.FMC_IO_LA17_P
FMC_IO_LA18_N: U12.AA18(IO_L24N_T3U_N11_64) ; port FMC_IO_LA17_33.FMC_IO_LA18_N
FMC_IO_LA18_P: U12.Y18(IO_L24P_T3U_N10_64) ; port FMC_IO_LA17_33.FMC_IO_LA18_P
FMC_IO_LA19_N: U12.P26(IO_L17N_T2U_N9_AD10N_D15_65) ; port FMC_IO_LA17_33.FMC_IO_LA19_N
FMC_IO_LA19_P: U12.P25(IO_L17P_T2U_N8_AD10P_D14_65) ; port FMC_IO_LA17_33.FMC_IO_LA19_P
FMC_IO_LA20_N: U12.U24(IO_L13N_T2L_N1_GC_QBC_A07_D23_65) ; port FMC_IO_LA17_33.FMC_IO_LA20_N
FMC_IO_LA20_P: U12.T24(IO_L13P_T2L_N0_GC_QBC_A06_D22_65) ; port FMC_IO_LA17_33.FMC_IO_LA20_P
FMC_IO_LA21_N: U12.V26(IO_L16N_T2U_N7_QBC_AD3N_A01_D17_65) ; port FMC_IO_LA17_33.FMC_IO_LA21_N
FMC_IO_LA21_P: U12.U26(IO_L16P_T2U_N6_QBC_AD3P_A00_D16_65) ; port FMC_IO_LA17_33.FMC_IO_LA21_P
FMC_IO_LA22_N: U12.W24(IO_L12N_T1U_N11_GC_A09_D25_65) ; port FMC_IO_LA17_33.FMC_IO_LA22_N
FMC_IO_LA22_P: U12.V24(IO_L12P_T1U_N10_GC_A08_D24_65) ; port FMC_IO_LA17_33.FMC_IO_LA22_P
FMC_IO_LA23_N: U12.AB19(IO_L20N_T3L_N3_AD1N_64) ; port FMC_IO_LA17_33.FMC_IO_LA23_N
FMC_IO_LA23_P: U12.AA19(IO_L20P_T3L_N2_AD1P_64) ; port FMC_IO_LA17_33.FMC_IO_LA23_P
FMC_IO_LA24_N: U12.AC24(IO_L6N_T0U_N11_AD6N_64) ; port FMC_IO_LA17_33.FMC_IO_LA24_N
FMC_IO_LA24_P: U12.AB24(IO_L6P_T0U_N10_AD6P_64) ; port FMC_IO_LA17_33.FMC_IO_LA24_P
FMC_IO_LA25_N: U12.AA25(IO_L9N_T1L_N5_AD12N_A15_D31_65) ; port FMC_IO_LA17_33.FMC_IO_LA25_N
FMC_IO_LA25_P: U12.AA24(IO_L9P_T1L_N4_AD12P_A14_D30_65) ; port FMC_IO_LA17_33.FMC_IO_LA25_P
FMC_IO_LA26_N: U12.V19(IO_L1N_T0L_N1_DBC_RS1_65) ; port FMC_IO_LA17_33.FMC_IO_LA26_N
FMC_IO_LA26_P: U12.U19(IO_L1P_T0L_N0_DBC_RS0_65) ; port FMC_IO_LA17_33.FMC_IO_LA26_P
FMC_IO_LA27_N: U12.Y26(IO_L8N_T1L_N3_AD5N_A17_65) ; port FMC_IO_LA17_33.FMC_IO_LA27_N
FMC_IO_LA27_P: U12.Y25(IO_L8P_T1L_N2_AD5P_A16_65) ; port FMC_IO_LA17_33.FMC_IO_LA27_P
FMC_IO_LA28_N: U12.AD19(IO_L14N_T2L_N3_GC_64) ; port FMC_IO_LA17_33.FMC_IO_LA28_N
FMC_IO_LA28_P: U12.AC19(IO_L14P_T2L_N2_GC_64) ; port FMC_IO_LA17_33.FMC_IO_LA28_P
FMC_IO_LA29_N: U12.AF25(IO_L3N_T0L_N5_AD15N_64) ; port FMC_IO_LA17_33.FMC_IO_LA29_N
FMC_IO_LA29_P: U12.AF24(IO_L3P_T0L_N4_AD15P_64) ; port FMC_IO_LA17_33.FMC_IO_LA29_P
FMC_IO_LA30_N: U12.AB20(IO_L21N_T3L_N5_AD8N_64) ; port FMC_IO_LA17_33.FMC_IO_LA30_N
FMC_IO_LA30_P: U12.AA20(IO_L21P_T3L_N4_AD8P_64) ; port FMC_IO_LA17_33.FMC_IO_LA30_P
FMC_IO_LA31_N: U12.AD18(IO_L16N_T2U_N7_QBC_AD3N_64) ; port FMC_IO_LA17_33.FMC_IO_LA31_N
FMC_IO_LA31_P: U12.AC18(IO_L16P_T2U_N6_QBC_AD3P_64) ; port FMC_IO_LA17_33.FMC_IO_LA31_P
FMC_IO_LA32_N: U12.AF20(IO_T1U_N12_64) ; port FMC_IO_LA17_33.FMC_IO_LA32_N
FMC_IO_LA32_P: U12.AF23(IO_T0U_N12_VRP_64) ; port FMC_IO_LA17_33.FMC_IO_LA32_P
FMC_IO_LA33_N: U12.P21(IO_L20N_T3L_N3_AD1N_D09_65) ; port FMC_IO_LA17_33.FMC_IO_LA33_N
FMC_IO_LA33_P: U12.P20(IO_L20P_T3L_N2_AD1P_D08_65) ; port FMC_IO_LA17_33.FMC_IO_LA33_P
FMC_PRSNT: U12.N26(IO_T2U_N12_CSI_ADV_B_65) ; port FMC_PRSNT
FMC_SCL: R29.2 U24.9(SC2) ; port FMC_SCL
FMC_SDA: R30.2 U24.8(SD2) ; port FMC_SDA
FPGA_I2C_RST: U12.G14(IO_L3N_AD13N_87) U24.3(~{RESET})
FPGA_I2C_SCL: U12.J15(IO_L4P_AD12P_87) U24.22(SCL)
FPGA_I2C_SDA: U12.J14(IO_L4N_AD12N_87) U24.23(SDA)
GPIO_0: J2.3 U12.G9(IO_L5N_HDGC_AD7N_86)
GPIO_1: J2.6 U12.F9(IO_L6N_HDGC_AD6N_86)
GPIO_2: J2.7 U12.E10(IO_L7N_HDGC_AD5N_86)
GPIO_3: J2.10 U12.D10(IO_L8N_HDGC_AD4N_86)
GPIO_4: J2.11 U12.D9(IO_L9P_AD3P_86)
GPIO_5: J2.14 U12.C9(IO_L9N_AD3N_86)
GPIO_6: J2.15 U12.A9(IO_L10N_AD2N_86)
GPIO_7: J2.18 U12.B9(IO_L10P_AD2P_86)
GPIO_8: J2.19 U12.A10(IO_L11N_AD1N_86)
GPIO_9: J2.22 U12.B10(IO_L11P_AD1P_86)
GPIO_10: J2.23 U12.B11(IO_L12N_AD0N_86)
GPIO_11: J2.26 U12.C11(IO_L12P_AD0P_86)
GPIO_12: J2.27 U12.D11(IO_L8P_HDGC_AD4P_86)
GPIO_13: J2.30 U12.E11(IO_L7P_HDGC_AD5P_86)
GPIO_14: J2.31 U12.F10(IO_L6P_HDGC_AD6P_86)
GPIO_15: J2.34 U12.G10(IO_L5P_HDGC_AD7P_86)
GPIO_16: J2.35 U12.AE13(IO_L2P_AD10P_84)
GPIO_17: J2.38 U12.AF13(IO_L2N_AD10N_84)
GPIO_18: J2.39 U12.AF14(IO_L1P_AD11P_84)
GPIO_19: J3.6 U12.AC13(IO_L5P_HDGC_AD7P_84)
GPIO_20: J3.3 U12.AD13(IO_L4P_AD8P_84)
GPIO_21: J3.10 U12.AE15(IO_L3N_AD9N_84)
GPIO_22: J3.7 U12.AF15(IO_L1N_AD11N_84)
GPIO_23: J3.14 U12.AC14(IO_L5N_HDGC_AD7N_84)
GPIO_24: J3.11 U12.Y13(IO_L11P_AD1P_84)
GPIO_25: J3.18 U12.AA14(IO_L8P_HDGC_AD4P_84)
GPIO_26: J3.15 U12.AB14(IO_L8N_HDGC_AD4N_84)
GPIO_27: J3.22 U12.Y15(IO_L7P_HDGC_AD5P_84)
GPIO_28: J3.19 U12.W15(IO_L10N_AD2N_84)
GPIO_29: J3.26 U12.Y16(IO_L9N_AD3N_84)
GPIO_30: J3.23 U12.W16(IO_L9P_AD3P_84)
GPIO_31: J3.30 U12.AA15(IO_L7N_HDGC_AD5N_84)
GPIO_32: J3.27 U12.AB16(IO_L6N_HDGC_AD6N_84)
GPIO_33: J3.34 U12.AD15(IO_L3P_AD9P_84)
GPIO_34: J3.31 U12.AB15(IO_L6P_HDGC_AD6P_84)
GPIO_35: J3.38 U12.W14(IO_L10P_AD2P_84)
GPIO_36: J3.35 U12.AD14(IO_L4N_AD8N_84)
ISNS_SCL: R25.2 U24.5(SC0) ; port ISNS_SCL
ISNS_SDA: R26.2 U24.4(SD0) ; port ISNS_SDA
LED0: U12.B14(IO_L12P_AD8P_87)
LED1: U12.A13(IO_L11P_AD9P_87)
LED2: U12.B12(IO_L10N_AD10N_87)
LED3: U12.A12(IO_L11N_AD9N_87)
LED4: U12.C13(IO_L9N_AD11N_87)
LED5: U12.C14(IO_L9P_AD11P_87)
LED6: U12.C12(IO_L10P_AD10P_87)
LED7: U12.A14(IO_L12N_AD8N_87)
ODT: U12.M21(IO_L2N_T0L_N3_66) ; port DDR IO.ODT
PCIE_RST_LV: U12.T19(IO_T3U_N12_PERSTN0_65) U13.4(Y) U14.2(A)
PCIE_WAKE: U12.AA13(IO_L11N_AD1N_84) ; port PCIE_WAKE
PERST_PCIe: U13.2(A) U14.4(Y) ; port PERST_PCIe
SD_CD: U12.G12(IO_L5P_HDGC_87) ; port SD Card IO.SD_CD
SD_CLK: U12.E12(IO_L7N_HDGC_87) ; port SD Card IO.SD_CLK
SD_CMD: U12.D13(IO_L8N_HDGC_87) ; port SD Card IO.SDD_CMD
SD_D0: U12.F12(IO_L5N_HDGC_87) ; port SD Card IO.SD_D0
SD_D1: U12.F13(IO_L6N_HDGC_87) ; port SD Card IO.SD_D1
SD_D2: U12.D14(IO_L8P_HDGC_87) ; port SD Card IO.SD_D2
SD_D3: U12.E13(IO_L7P_HDGC_87) ; port SD Card IO.SD_D3
SD_RST: U12.F14(IO_L6P_HDGC_87) ; port SD Card IO.SD_RST
SW0: U12.H11(IO_L4P_AD8P_86)
SW1: U12.G11(IO_L4N_AD8N_86)
SW2: U12.J11(IO_L2P_AD10P_86)
SW3: U12.J10(IO_L2N_AD10N_86)
SW4: U12.K10(IO_L1P_AD11P_86)
SW5: U12.K9(IO_L1N_AD11N_86)
SW6: U12.H9(IO_L3N_AD9N_86)
SW7: U12.J9(IO_L3P_AD9P_86)
SYS_CLK_N: R34.1 U12.K23(IO_L11N_T1U_N9_GC_66) X1.5(Out_N)
SYS_CLK_P: R34.2 U12.K22(IO_L11P_T1U_N8_GC_66) X1.4(Out_P)
SYS_RST: R33.2 U12.J12(IO_L1P_AD15P_87)
TDQS_T: U12.E25(IO_L19P_T3L_N0_DBC_AD9P_66) ; port DDR IO.TDQS_T
TSNS_SCL: R27.2 U24.7(SC1) ; port TSNS_SCL
TSNS_SDA: R28.2 U24.6(SD1) ; port TSNS_SDA
U_SCL0: J1.3 R31.2 U24.16(SC5)
U_SCL1: J1.7 R51.2 U24.18(SC6)
U_SCL2: J1.11 R66.2 U24.20(SC7)
U_SDA0: J1.4 R50.2 U24.15(SD5)
U_SDA1: J1.8 R52.2 U24.17(SD6)
U_SDA2: J1.12 R67.2 U24.19(SD7)
UART_RX: U12.H14(IO_L3P_AD13P_87) ; port UART_RX
UART_TX: U12.H13(IO_L2N_AD14N_87) ; port UART_TX
NetC113_2: C113.2 FB1.2 R35.2 X1.6(VDD)
NetR19_1: R19.1 U12.M22(IO_T0U_N12_VRP_66)
NetR32_2: R32.2 R33.1 Reset1.A Reset1.A'
NetR35_1: R35.1 X1.1(EN)

Not connected (* = marked no-connect by the designer): J3 39; U12 E26(IO_L19N_T3L_N1_DBC_AD9N_66) F22(IO_T3U_N12_66) G22(IO_T2U_N12_66) J16(VREF_67) J18(VREF_66) J21(IO_L5N_T0U_N9_AD14N_66) K20(IO_L6N_T0U_N11_AD6N_66) K21(IO_L5P_T0U_N8_AD14P_66) L19(IO_L4N_T0U_N7_DBC_AD7N_66) L20(IO_L6P_T0U_N10_AD6P_66) M19(IO_L4P_T0U_N6_DBC_AD7P_66) M24(IO_T1U_N12_66) V18(VREF_65) W18(VREF_64); U13 1(NC)*; U14 1(NC)*; U24 13(SD4) 14(SC4); X1 2(NC)*

## Buses and harness runs
bus LED[0..7] = port LED[0..7]
bus SW[0..7] = port SW[0..7]

## Layout directives
differential pair: CK_C, CK_T, DQS_C, DQS_T, SYS_CLK_N, SYS_CLK_P
net class DDR_DATA: DQ0, DQ1, DQ2, DQ3, DQ4, DQ5, DQ6, DQ7
net class DDR_ADDR: A0, A1, A2, A3, A4, A5, A6, A7, A8, A9, A10, A11, A12, A13, A14, A15, A16, A17
net class DDR_BG/BA: BA0, BA1, BG0, BG1
net class DDR_CMC: ACT_N, CK_C, CK_T, CKE, CS_N, DDR_RST, DQS_C, DQS_T, ODT, TDQS_T

## Notes on the sheet
- DDR Interface generated in Vivado MIG for IOB 66
- SYS clock timing has been manually set to the following:
- - DDR Clk is 1000Mhz
- - M = 15
- Note: SET ODT to RTT_48
- DRAM PINOUT GENERATED USING DDR4 MIG2.2
- Reference Part used: MT40A2G8VA-062E
- Equivelant In-stock part: MT40A2G8GSA-063E
- - D = 1
- - D0 = 6
- }
- Ref CLK (SYS_CLK) = 100Mhz
- R19 ENABLES DCI
- TQDS = DBI
- 1.2V
- 1.8V
- FMC IO Bank A
- (near U12) 3.3V
- 3.3V
- FMC IO Bank B
- Bi-Directional Logic Shifter (Uses two single direction buffers)
- - PCIE_RST_LV Must be 1.8V Logic
- (near U13) - PCIE_RST Must be 3.3V Logic
- Pullups on ADC Sheet
- (near J1) USER I2C
- User 3.3V GPIO
- USER I2C Pullups
- FPGA IO
- 4
- 15
- Dragon Enjoyer
- B
- (in symbol CMP-020-00023-3, part B) Bank 67
- (in symbol CMP-020-00023-3, part C) Bank 66
- (in symbol CMP-020-00023-3, part D) Bank 65
- (in symbol CMP-020-00023-3, part E) Bank 64
- (in symbol CMP-020-00023-3, part F) Bank 87
- (in symbol CMP-020-00023-3, part G) Bank 86
- (in symbol CMP-020-00023-3, part H) Bank 84

## Library data of the parts
C14 C15 C110 C112-C114 C185 C187 C188 = CMP-2008-02743-1: Manufacturer: AVX Interconnect / Elco; Part Number: 04026D104KAT2A
C111 = CMP-2007-03555-1: Manufacturer: Murata; Part Number: GRM21BR71A475KA73L
FB1 = CMP-0686-00581-3: Chip Ferrite Bead, 0603, 600Ω @ 100MHz, 0.15Ω, 25%, 1.3A; Material: Steel; Number of Lines: 1; DC Resistance (DCR): 150mR; Tolerance: 25%; Case Code (Metric): 1608; Width: 0.8mm; DC Current: 1.3A; Max DC Current: 1.3A; Package Quantity: 1; Number of Pins: 2; Military Standard: Not; RoHS Compliant: Yes; Termination: SMD/SMT; Max Operating Temperature: 125°C; Length: 1.6mm; Depth: 0.8mm; Case Code (Imperial): 0603; Series: BLM18K; Inductor Type: FERRITE BEAD; Core Material: Ferrite; Number of Circuits: 1; Height: 0.8mm; Case/Package: 0603; REACH SVHC: No SVHC; Packaging: Tape and Reel; Min Operating Temperature: -55°C; Max Current Rating: 1.3A; Radiation Hardening: No; Current Rating: 1.3A; Lead Free: Lead Free; Test Frequency: 100MHz; Weight: 7.1E-05oz
J1 = CMP-25680-000041-1: CONN HEADER SMD 12POS 2MM; Number of Positions: 12; Row Spacing: 0.079inch; Connector Type: Male Pin; Contact Plating: Gold; Packaging: Bulk; Contact Type: Male Pin; Contact Mating Length: 0.157inch; Number of Rows: 2; Pitch: 0.079inch; Package Quantity: 1000; Mount: Surface Mount; Lead Free: Lead Free; Contact Material: Brass; RoHS Compliant: Yes; Width: 4mm; Housing Material: Nylon; Termination: Solder; Length: 12mm; Height: 1.5mm
J2 J3 = CMP-1502-00028-1: Male Box Header WR-BHD, THT, Angled, pitch 2.54 mm, 40 pins; Manufacturer: Wurth Elektronik; Withstanding Voltage: 500VAC; Pitch: 2.54mm; Working Voltage: 250VAC; Contact Resistance: 20mOhm; Pin Number: 40; Gender: Male; Operating Temperature: -40to125degC; Publisher: WurthElektronik; Orientation: Angled; Published Date: August2018; Datasheet URL: https://katalog.we-online.de/em/datasheet/6120xx21721.pdf; Packaging: Tray; Manufacturer URL: http://www.we-online.de; Mounting Technology: THT; Part Number: 61204021721; Package Reference: 61204021721
R19 = CMP-2002-08397-1: Manufacturer: Vishay Dale; Part Number: CRCW0402240RFKED
R25-R33 R35 R50-R52 R66 R67 = CMP-2002-08011-1: Manufacturer: Yageo / Phycomp; Part Number: RC0402JR-074K7L
R34 = CMP-2002-00605-3: Chip Resistor, 100 Ohm, +/- 1%, 100 mW, -55 to 155 degC, 0402 (1005 Metric), RoHS, Tape and Reel; Manufacturer: Basic Passives; Power Rating: 100 mW; Voltage Rating: 50 V; Case\/Package: 0402; Width: 0.5 mm; Pins: 2; ComponentLink2Description: Datasheet; PackageReference: 0402; Height: 0.35 mm; Tolerance: 1%; DatasheetVersion: 04/2015; Case Code (Imperial): 0402; Min Operating Temperature: -55 degC; Radiation Hardening: No; Length: 1 mm; Package Quantity: 10000; PackageDescription: 2-Pin Surface Mount Device, Body 1 x 0.5 mm; Mounting Technology: Surface Mount; Case Code (Metric): 1005; Packaging: Tape and Reel; ComponentLink1URL: http://www.panasonic.com/; RoHSCompliant: true; Max Operating Temperature: 155 degC; REACH SVHC: Yes; PartNumber: ERJ-2RKF1000X; ComponentLink1Description: Manufacturer URL; ComponentLink2URL: http://industrial.panasonic.com/cdbs/www-data/pdf/RDA0000/AOA0000C86.pdf; Mount: Surface Mount
Reset1 = CMP-05618-000012-1: SWITCH TACTILE SPST-NO 0.02A 15V; Manufacturer: Panasonic; Contact Current Rating: 20mA; Contact Resistance: 100mΩ; Operating Force: 2.6N; Electromechanical Life: 200000Cycles; Height: 3.3mm; Device Class L3: Tactile Switches; Voltage Rating Dc: 15V; Temperature: -40°C to +85°C; Device Class L1: Electromechanical; Manufacturer Part Number: EVQ-Q2U03W; Mount: Surface Mount; ComponentLink2Description: Datasheet; Automotive: No; Lead Free: Yes; Throw Configuration: SPST-NO; RoHS: TRUE; ComponentLink2URL: https://industrial.panasonic.com/cdbs/www-data/pdf/ATK0000/ATK0000C360.pdf; Package: EVQQ2; Temperature Range High: +85°C; Temperature Range Low: -40°C; Mouser Description: Tactile Switches 2.6NF 6.5x6.0x3.1mm; Digikey Description: SWITCH TACTILE SPST-NO 0.02A 15V; Octopart: https://octopart.com/evq-q2u03w-panasonic-1404553; Category: Switch; Device Class L2: Switches
U12 = CMP-020-00023-3: FPGA XCAU25 Family 308437 Logic Units 308437 Cells 0.85V 676-Pin FCBGA
U13 U14 = CMP-016-00010-1: IC BUFFER GATE SGL CMOS SOT23-5
U24 = CMP-04892-000002-1: IC I2C SW 8CH W/RESET 24TSSOP; Manufacturer: Texas Instruments; Number Of Circuits: 1; Mux Demux Ratio: 1:8; Nominal Supply Current: 2-50uA; Interface: I2C,SMBus; Min Supply Voltage: 1.65V; Standoff Height: 0.05mm; Max Supply Voltage: 5.5V; Device Class L2: Interface ICs; ComponentLink2Description: Datasheet; Ipc Land Pattern Name: SOP65P640X120-24; Category: IC; Device Class L1: Integrated Circuits (ICs); Manufacturer Part Number: TCA9548APWR; RoHS: TRUE; Temperature Range High: +85°C; Digikey Description: IC I2C SW 8CH W/RESET 24TSSOP; Temperature Range Low: -40°C; Lead Free: Yes; Package: PW0024A; ComponentLink2URL: http://www.ti.com/lit/ds/symlink/tca9548a.pdf; Device Class L3: Multiplexers; Ambient Temperature Range Low: -40°C; Mouser Description: Low-Voltage 8-Channel I2C Switch With Reset 24-TSSOP -40 to 85; Temperature: -40°C to +85°C; Octopart: https://octopart.com/tca9548apwr-texas+instruments-22266789; Ambient Temperature Range High: +85°C; Automotive: No; Height: 1.2mm
X1 = CMP-003-00030-1: Oscillator XO 100MHz ±50ppm LVDS 55% 1.8V 6-Pin SMD Bulk